# Altium schematic sheet УШЯИ.411618.029Э Э3 Лист 2.schdoc (part 2 of 2)
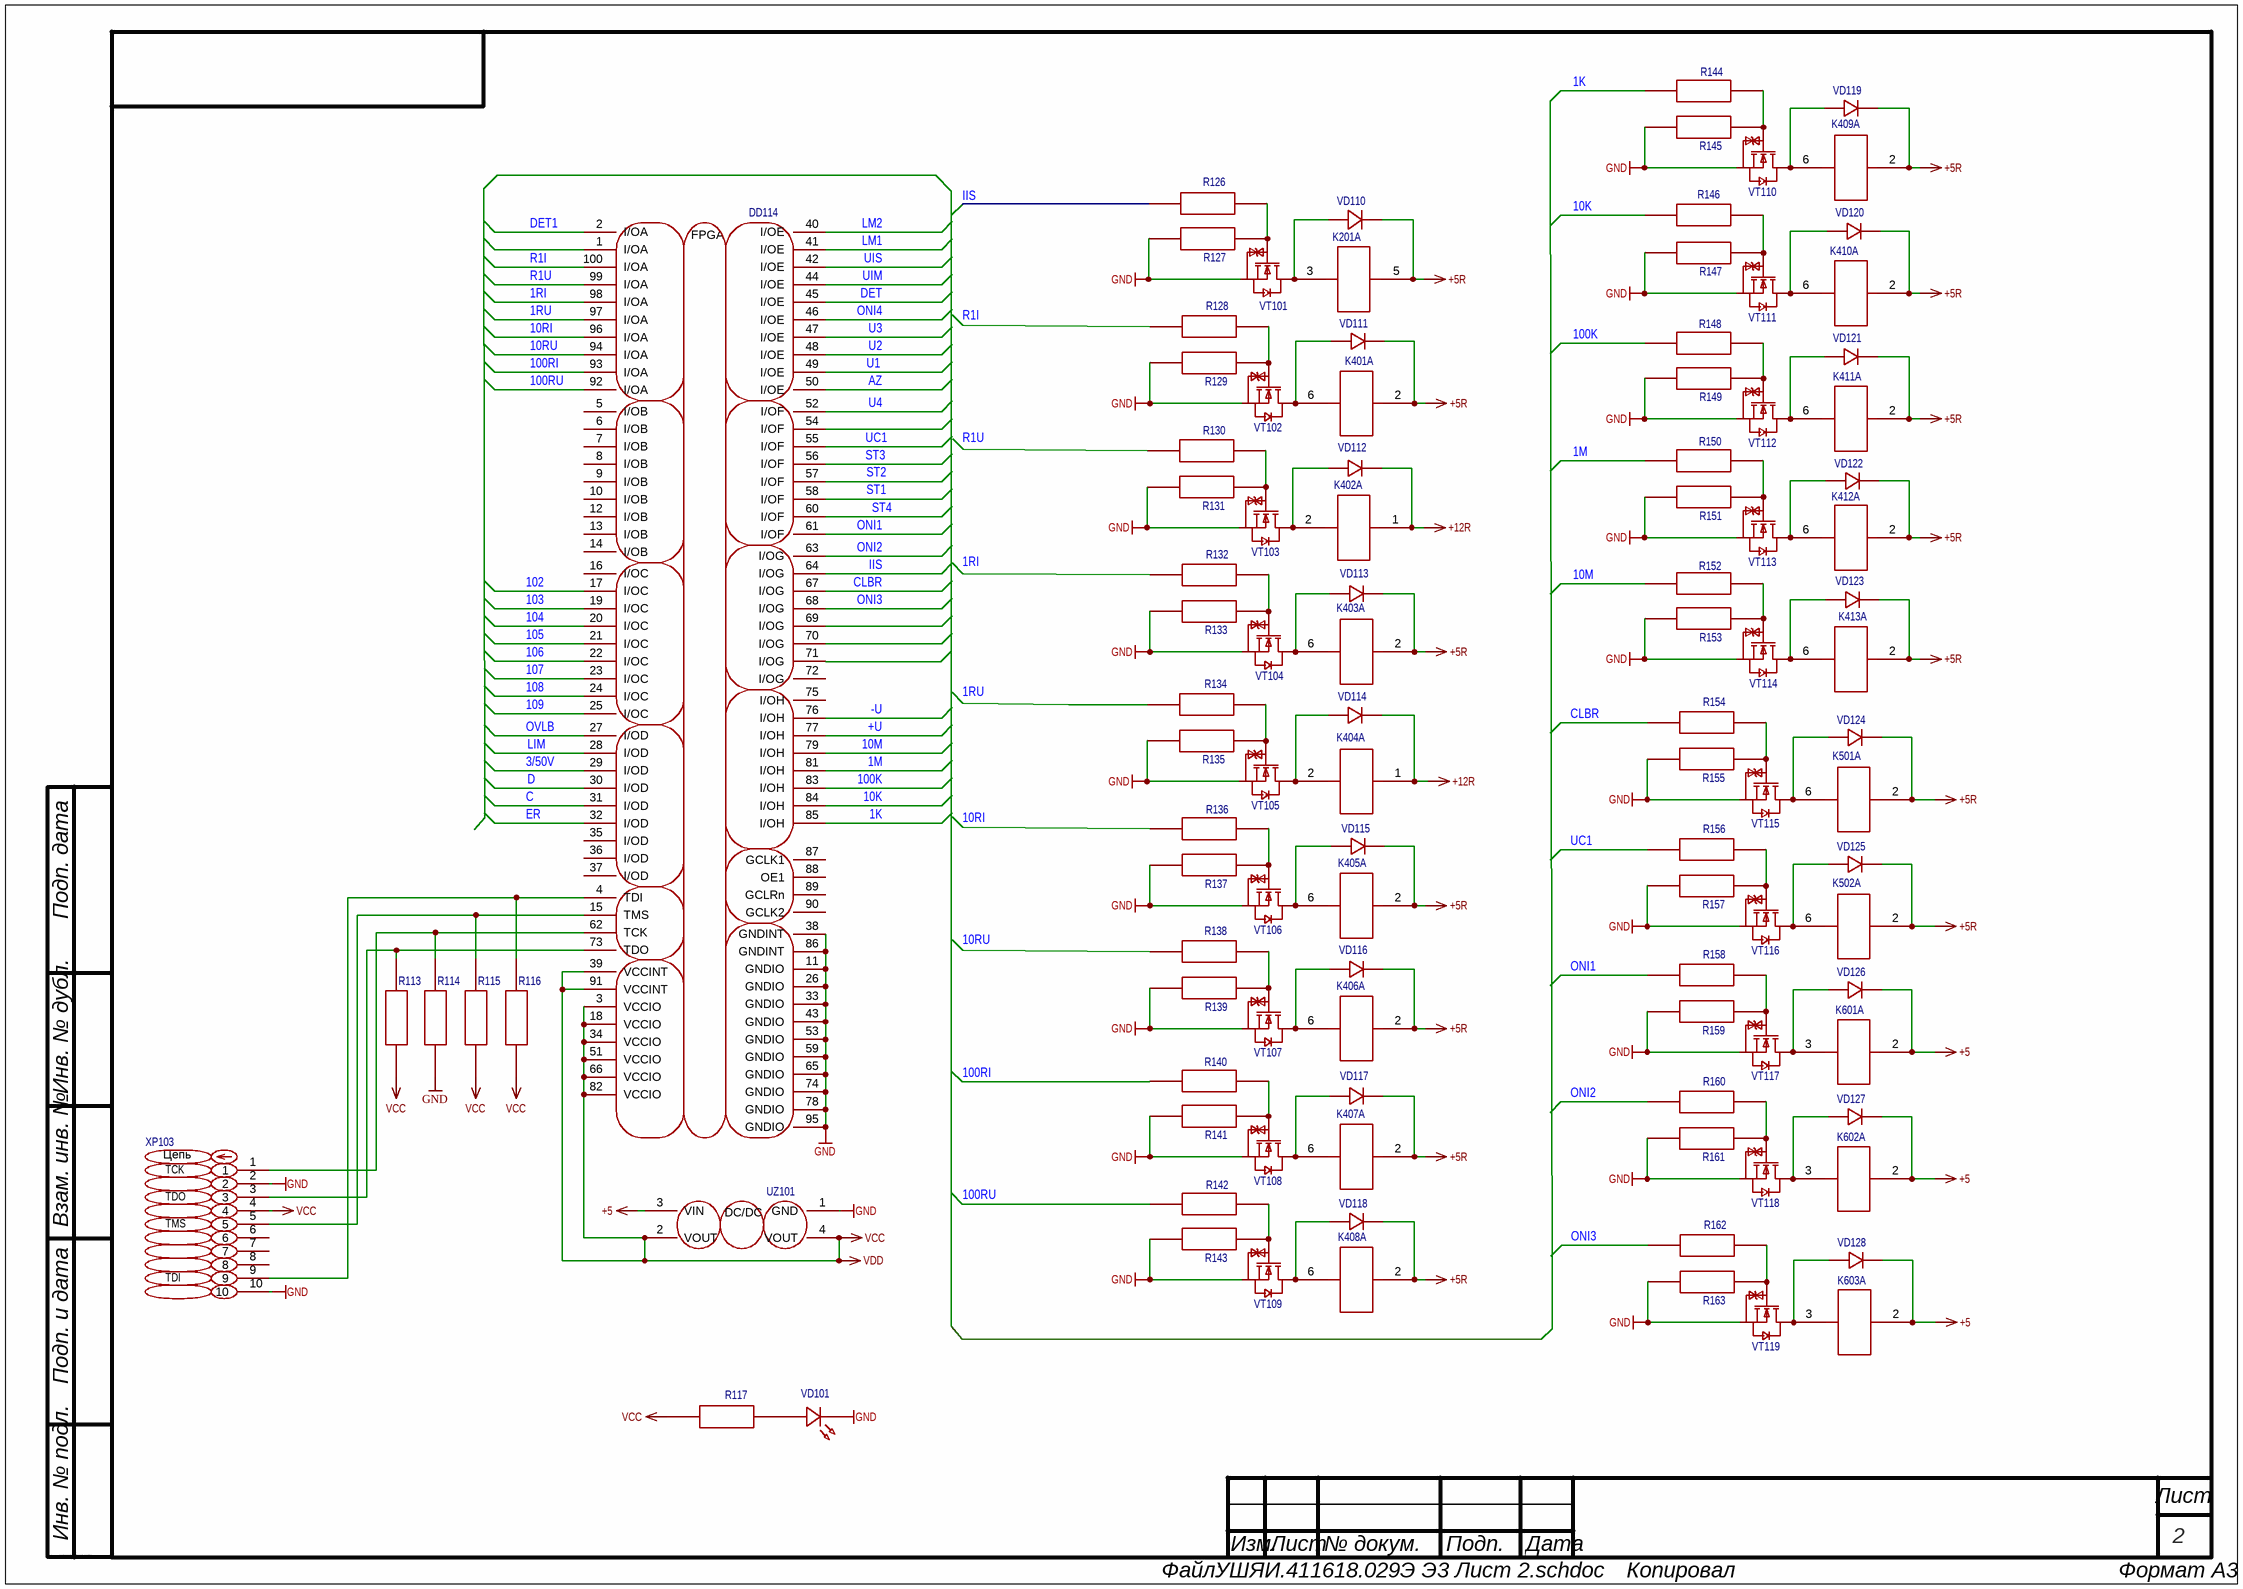
[diagram p1: УШЯИ.411618.029Э Э3 Лист 2.schdoc]

## Library data of the parts
DD114 = ПЛИС EPM3128ATC100-10N [TQFP-100]: Manufacturer: Intel/Altera; Contributor: jordanjin; Convert to PCB: yes; UniqueId: gge69bfa431c52bedcc; Origin Footprint: TQFP-100_L14.0-W14.0-P0.50-LS16.0-BL; Device: ПЛИС EPM3128ATC100-10N [TQFP-100]; Symbol: ПЛИС EPM3128ATC100-10N [TQFP-100]; spicePre: X; Supplier: LCSC; Manufacturer Part: EPM3128ATC100-10N; JLCPCB Part Class: Extended Part; spiceSymbolName: ПЛИС EPM3128ATC100-10N [TQFP-100]; Add into BOM: yes; FootprintName: TQFP-100_L14.0-W14.0-P0.50-LS16.0-BL
K201 = Реле герконовое SIL05-1A72-71L [PCB]: Manufacturer: STANDEXMEDER; subpart_no: 1; Origin Footprint: RELAY-TH_4P-L20.6-W5.9_STANDEXMEDER_SIL12-1A72-71L; Contributor: jordanjin; Convert to PCB: yes; UniqueId: gge5a920c36dc7e1466; ModelId: 7150b5ec7bbe4c7fa168fd25340efd63; Device: Реле герконовое SIL05-1A72-71L [PCB]; Symbol: Реле герконовое SIL05-1A72-71L [PCB]; Supplier: LCSC; Manufacturer Part: SIL05-1A72-71L; JLCPCB Part Class: Extended Part; spicePre: K; spiceSymbolName: Реле герконовое SIL05-1A72-71L [PCB]; Add into BOM: yes; FootprintName: RELAY-TH_4P-L20.6-W5.9_STANDEXMEDER_SIL12-1A72-71L; ModelName: RELAY-TH_4P-L20.6-W5.9_STANDEXMEDER_SIL12-1A72-71L
K401 = Реле герконовое DIP05-1A72-13L  [PCB]: Manufacturer: STANDEXMEDER; subpart_no: 1; Contributor: jordanjin; Convert to PCB: yes; UniqueId: ggea45fc22cc44c2d75; Origin Footprint: RELAY-TH_STANDEXMEDER_DIP05-1A72-13L; Device: Реле герконовое DIP05-1A72-13L  [PCB]; Symbol: Реле герконовое DIP05-1A72-13L  [PCB]; Supplier: LCSC; Supplier Part: C1524853; Manufacturer Part: DIP05-1A72-13L; JLCPCB Part Class: Extended Part; spicePre: K; spiceSymbolName: Реле герконовое DIP05-1A72-13L  [PCB]; Add into BOM: yes; FootprintName: RELAY-TH_STANDEXMEDER_DIP05-1A72-13L
K402 = Реле герконовое УШЯИ.685442.092 (2 реле): Manufacturer: ОАО"МНИПИ"; Part Number: 1; Origin Footprint: УШЯИ.685442.092 В2; Contributor: jordanjin; Convert to PCB: yes; UniqueId: ggedd096f2fa000e1a3; Device: Реле герконовое УШЯИ.685442.092 (2 реле); Symbol: Реле герконовое УШЯИ.685442.092 (2 реле); Supplier: LCSC; Manufacturer Part: УШЯИ.685442.092; Subpart_no: 1; Add into BOM: yes; spicePre: K; spiceSymbolName: Реле герконовое УШЯИ.685442.092 (2 реле)
K403 = Реле герконовое DIP05-1A72-13L  [PCB]: Manufacturer: STANDEXMEDER; subpart_no: 1; Contributor: jordanjin; Convert to PCB: yes; UniqueId: gge7b256544bc94d3e2; Origin Footprint: RELAY-TH_STANDEXMEDER_DIP05-1A72-13L; Device: Реле герконовое DIP05-1A72-13L  [PCB]; Symbol: Реле герконовое DIP05-1A72-13L  [PCB]; Supplier: LCSC; Supplier Part: C1524853; Manufacturer Part: DIP05-1A72-13L; JLCPCB Part Class: Extended Part; spicePre: K; spiceSymbolName: Реле герконовое DIP05-1A72-13L  [PCB]; Add into BOM: yes; FootprintName: RELAY-TH_STANDEXMEDER_DIP05-1A72-13L
K404 = Реле герконовое УШЯИ.685442.092 (1 реле): Manufacturer: ОАО"МНИПИ"; subpart_no: 1; Contributor: jordanjin; Convert to PCB: yes; UniqueId: ggec0474dfb349761fe; Origin Footprint: УШЯИ.685442.092; Device: Реле герконовое УШЯИ.685442.092 (1 реле); Symbol: Реле герконовое УШЯИ.685442.092 (1 реле); Supplier: LCSC; Manufacturer Part: УШЯИ.685442.092; JLCPCB Part Class: Extended Part; spicePre: K; spiceSymbolName: Реле герконовое УШЯИ.685442.092 (1 реле); Add into BOM: yes
K405 = Реле герконовое DIP05-1A72-13L  [PCB]: Manufacturer: STANDEXMEDER; subpart_no: 1; Contributor: jordanjin; Convert to PCB: yes; UniqueId: gge1f76a7dc702d7620; Origin Footprint: RELAY-TH_STANDEXMEDER_DIP05-1A72-13L; Device: Реле герконовое DIP05-1A72-13L  [PCB]; Symbol: Реле герконовое DIP05-1A72-13L  [PCB]; Supplier: LCSC; Supplier Part: C1524853; Manufacturer Part: DIP05-1A72-13L; JLCPCB Part Class: Extended Part; spicePre: K; spiceSymbolName: Реле герконовое DIP05-1A72-13L  [PCB]; Add into BOM: yes; FootprintName: RELAY-TH_STANDEXMEDER_DIP05-1A72-13L
K406 = Реле герконовое DIP05-1A72-13L  [PCB]: Manufacturer: STANDEXMEDER; subpart_no: 1; Contributor: jordanjin; Convert to PCB: yes; UniqueId: gge00973bedd4b06ae6; Origin Footprint: RELAY-TH_STANDEXMEDER_DIP05-1A72-13L; Device: Реле герконовое DIP05-1A72-13L  [PCB]; Symbol: Реле герконовое DIP05-1A72-13L  [PCB]; Supplier: LCSC; Supplier Part: C1524853; Manufacturer Part: DIP05-1A72-13L; JLCPCB Part Class: Extended Part; spicePre: K; spiceSymbolName: Реле герконовое DIP05-1A72-13L  [PCB]; Add into BOM: yes; FootprintName: RELAY-TH_STANDEXMEDER_DIP05-1A72-13L
K407 = Реле герконовое DIP05-1A72-13L  [PCB]: Manufacturer: STANDEXMEDER; subpart_no: 1; Contributor: jordanjin; Convert to PCB: yes; UniqueId: gge7eb223ed67f315be; Origin Footprint: RELAY-TH_STANDEXMEDER_DIP05-1A72-13L; Device: Реле герконовое DIP05-1A72-13L  [PCB]; Symbol: Реле герконовое DIP05-1A72-13L  [PCB]; Supplier: LCSC; Supplier Part: C1524853; Manufacturer Part: DIP05-1A72-13L; JLCPCB Part Class: Extended Part; spicePre: K; spiceSymbolName: Реле герконовое DIP05-1A72-13L  [PCB]; Add into BOM: yes; FootprintName: RELAY-TH_STANDEXMEDER_DIP05-1A72-13L
K408 = Реле герконовое DIP05-1A72-13L  [PCB]: Manufacturer: STANDEXMEDER; subpart_no: 1; Contributor: jordanjin; Convert to PCB: yes; UniqueId: ggea0a2675062cebf5e; Origin Footprint: RELAY-TH_STANDEXMEDER_DIP05-1A72-13L; Device: Реле герконовое DIP05-1A72-13L  [PCB]; Symbol: Реле герконовое DIP05-1A72-13L  [PCB]; Supplier: LCSC; Supplier Part: C1524853; Manufacturer Part: DIP05-1A72-13L; JLCPCB Part Class: Extended Part; spicePre: K; spiceSymbolName: Реле герконовое DIP05-1A72-13L  [PCB]; Add into BOM: yes; FootprintName: RELAY-TH_STANDEXMEDER_DIP05-1A72-13L
K409 = Реле герконовое DIP05-1A72-13L  [PCB]: Manufacturer: STANDEXMEDER; subpart_no: 1; Contributor: jordanjin; Convert to PCB: yes; UniqueId: ggee83d63be2b7c682e; Origin Footprint: RELAY-TH_STANDEXMEDER_DIP05-1A72-13L; Device: Реле герконовое DIP05-1A72-13L  [PCB]; Symbol: Реле герконовое DIP05-1A72-13L  [PCB]; Supplier: LCSC; Supplier Part: C1524853; Manufacturer Part: DIP05-1A72-13L; JLCPCB Part Class: Extended Part; spicePre: K; spiceSymbolName: Реле герконовое DIP05-1A72-13L  [PCB]; Add into BOM: yes; FootprintName: RELAY-TH_STANDEXMEDER_DIP05-1A72-13L
K410 = Реле герконовое DIP05-1A72-13L  [PCB]: Manufacturer: STANDEXMEDER; subpart_no: 1; Contributor: jordanjin; Convert to PCB: yes; UniqueId: gge77497d8361c4598c; Origin Footprint: RELAY-TH_STANDEXMEDER_DIP05-1A72-13L; Device: Реле герконовое DIP05-1A72-13L  [PCB]; Symbol: Реле герконовое DIP05-1A72-13L  [PCB]; Supplier: LCSC; Supplier Part: C1524853; Manufacturer Part: DIP05-1A72-13L; JLCPCB Part Class: Extended Part; spicePre: K; spiceSymbolName: Реле герконовое DIP05-1A72-13L  [PCB]; Add into BOM: yes; FootprintName: RELAY-TH_STANDEXMEDER_DIP05-1A72-13L
K411 = Реле герконовое DIP05-1A72-13L  [PCB]: Manufacturer: STANDEXMEDER; subpart_no: 1; Contributor: jordanjin; Convert to PCB: yes; UniqueId: gge695ef8e117c221b6; Origin Footprint: RELAY-TH_STANDEXMEDER_DIP05-1A72-13L; Device: Реле герконовое DIP05-1A72-13L  [PCB]; Symbol: Реле герконовое DIP05-1A72-13L  [PCB]; Supplier: LCSC; Supplier Part: C1524853; Manufacturer Part: DIP05-1A72-13L; JLCPCB Part Class: Extended Part; spicePre: K; spiceSymbolName: Реле герконовое DIP05-1A72-13L  [PCB]; Add into BOM: yes; FootprintName: RELAY-TH_STANDEXMEDER_DIP05-1A72-13L
K412 = Реле герконовое DIP05-1A72-13L  [PCB]: Manufacturer: STANDEXMEDER; subpart_no: 1; Contributor: jordanjin; Convert to PCB: yes; UniqueId: ggef9bf3a281ed54a33; Origin Footprint: RELAY-TH_STANDEXMEDER_DIP05-1A72-13L; Device: Реле герконовое DIP05-1A72-13L  [PCB]; Symbol: Реле герконовое DIP05-1A72-13L  [PCB]; Supplier: LCSC; Supplier Part: C1524853; Manufacturer Part: DIP05-1A72-13L; JLCPCB Part Class: Extended Part; spicePre: K; spiceSymbolName: Реле герконовое DIP05-1A72-13L  [PCB]; Add into BOM: yes; FootprintName: RELAY-TH_STANDEXMEDER_DIP05-1A72-13L
K413 = Реле герконовое DIP05-1A72-13L  [PCB]: Manufacturer: STANDEXMEDER; subpart_no: 1; Contributor: jordanjin; Convert to PCB: yes; UniqueId: gge75a4dccec15134f1; Origin Footprint: RELAY-TH_STANDEXMEDER_DIP05-1A72-13L; Device: Реле герконовое DIP05-1A72-13L  [PCB]; Symbol: Реле герконовое DIP05-1A72-13L  [PCB]; Supplier: LCSC; Supplier Part: C1524853; Manufacturer Part: DIP05-1A72-13L; JLCPCB Part Class: Extended Part; spicePre: K; spiceSymbolName: Реле герконовое DIP05-1A72-13L  [PCB]; Add into BOM: yes; FootprintName: RELAY-TH_STANDEXMEDER_DIP05-1A72-13L
K501 = Реле герконовое DIP05-1A72-13L  [PCB]: Manufacturer: STANDEXMEDER; subpart_no: 1; Contributor: jordanjin; Convert to PCB: yes; UniqueId: ggee1438345d4d73398; Origin Footprint: RELAY-TH_STANDEXMEDER_DIP05-1A72-13L; Device: Реле герконовое DIP05-1A72-13L  [PCB]; Symbol: Реле герконовое DIP05-1A72-13L  [PCB]; Supplier: LCSC; Supplier Part: C1524853; Manufacturer Part: DIP05-1A72-13L; JLCPCB Part Class: Extended Part; spicePre: K; spiceSymbolName: Реле герконовое DIP05-1A72-13L  [PCB]; Add into BOM: yes; FootprintName: RELAY-TH_STANDEXMEDER_DIP05-1A72-13L
K502 = Реле герконовое DIP05-1A72-13L  [PCB]: Manufacturer: STANDEXMEDER; subpart_no: 1; Contributor: jordanjin; Convert to PCB: yes; UniqueId: ggee8b9abbf2c4f7e1a; Origin Footprint: RELAY-TH_STANDEXMEDER_DIP05-1A72-13L; Device: Реле герконовое DIP05-1A72-13L  [PCB]; Symbol: Реле герконовое DIP05-1A72-13L  [PCB]; Supplier: LCSC; Supplier Part: C1524853; Manufacturer Part: DIP05-1A72-13L; JLCPCB Part Class: Extended Part; spicePre: K; spiceSymbolName: Реле герконовое DIP05-1A72-13L  [PCB]; Add into BOM: yes; FootprintName: RELAY-TH_STANDEXMEDER_DIP05-1A72-13L
K601 = Реле герконовое DIP05-1C90-51L [PCB]: Manufacturer: STANDEXMEDER; subpart_no: 1; Origin Footprint: RELAY-TH_STANDEXMEDER_DIP05-1C90-51L; Contributor: jordanjin; Convert to PCB: yes; UniqueId: ggef1f82220597a25dc; ModelId: 9ce20f042c4243a9be1ebcff3b9f4bf9; Device: Реле герконовое DIP05-1C90-51L [PCB]; Symbol: Реле герконовое DIP05-1C90-51L [PCB]; Supplier: LCSC; Manufacturer Part: DIP05-1C90-51L; JLCPCB Part Class: Extended Part; spicePre: K; spiceSymbolName: Реле герконовое DIP05-1C90-51L [PCB]; Add into BOM: yes; FootprintName: RELAY-TH_STANDEXMEDER_DIP05-1C90-51L; ModelName: RELAY-TH_STANDEXMEDER_DIP05-1C90-51L
K602 K603 = Реле герконовое DIP05-1C90-51L [PCB]: Manufacturer: STANDEXMEDER; subpart_no: 1; Origin Footprint: RELAY-TH_STANDEXMEDER_DIP05-1C90-51L; Contributor: jordanjin; Convert to PCB: yes; UniqueId: gge32902d80266dcdbb; ModelId: 9ce20f042c4243a9be1ebcff3b9f4bf9; Device: Реле герконовое DIP05-1C90-51L [PCB]; Symbol: Реле герконовое DIP05-1C90-51L [PCB]; Supplier: LCSC; Manufacturer Part: DIP05-1C90-51L; JLCPCB Part Class: Extended Part; spicePre: K; spiceSymbolName: Реле герконовое DIP05-1C90-51L [PCB]; Add into BOM: yes; FootprintName: RELAY-TH_STANDEXMEDER_DIP05-1C90-51L; ModelName: RELAY-TH_STANDEXMEDER_DIP05-1C90-51L
R113 = Резистор 1кОм 0,125Вт 1% [0805]: Contributor: jordanjin; Convert to PCB: yes; UniqueId: ggefc65a99cb1671a37; ModelId: de27d504f5024d53a3020ec2611f5e5e; Origin Footprint: R0805; Device: Резистор 1кОм 0,125Вт 1% [0805]; Symbol: Резистор 1кОм 0,125Вт 1% [0805]; Manufacturer Part: R0805; spicePre: R; spiceSymbolName: Резистор 12кОм 0,125Вт 1% [0805]; Add into BOM: yes; FootprintName: R0805; ModelName: R0805
R114 = Резистор 1кОм 0,125Вт 1% [0805]: Contributor: jordanjin; Convert to PCB: yes; UniqueId: ggec2b6080563c7f1a9; ModelId: de27d504f5024d53a3020ec2611f5e5e; Origin Footprint: R0805; Device: Резистор 1кОм 0,125Вт 1% [0805]; Symbol: Резистор 1кОм 0,125Вт 1% [0805]; Manufacturer Part: R0805; spicePre: R; spiceSymbolName: Резистор 12кОм 0,125Вт 1% [0805]; Add into BOM: yes; FootprintName: R0805; ModelName: R0805
R115 = Резистор 1кОм 0,125Вт 1% [0805]: Contributor: jordanjin; Convert to PCB: yes; UniqueId: gge64c21d50f88cd611; ModelId: de27d504f5024d53a3020ec2611f5e5e; Origin Footprint: R0805; Device: Резистор 1кОм 0,125Вт 1% [0805]; Symbol: Резистор 1кОм 0,125Вт 1% [0805]; Manufacturer Part: R0805; spicePre: R; spiceSymbolName: Резистор 12кОм 0,125Вт 1% [0805]; Add into BOM: yes; FootprintName: R0805; ModelName: R0805
R116 = Резистор 1кОм 0,125Вт 1% [0805]: Contributor: jordanjin; Convert to PCB: yes; UniqueId: gge7a48b93cbe1f66c7; ModelId: de27d504f5024d53a3020ec2611f5e5e; Origin Footprint: R0805; Device: Резистор 1кОм 0,125Вт 1% [0805]; Symbol: Резистор 1кОм 0,125Вт 1% [0805]; Manufacturer Part: R0805; spicePre: R; spiceSymbolName: Резистор 12кОм 0,125Вт 1% [0805]; Add into BOM: yes; FootprintName: R0805; ModelName: R0805
R117 = Резистор 100Ом 0,125Вт 1% [0805]: Contributor: jordanjin; Convert to PCB: yes; UniqueId: gge264200b346de9972; ModelId: de27d504f5024d53a3020ec2611f5e5e; Origin Footprint: R0805; Device: Резистор 100Ом 0,125Вт 1% [0805]; Symbol: Резистор 100Ом 0,125Вт 1% [0805]; Manufacturer Part: R0805; spicePre: R; spiceSymbolName: Резистор 12кОм 0,125Вт 1% [0805]; Add into BOM: yes; FootprintName: R0805; ModelName: R0805
R126 = Резистор 100Ом 0,125Вт 1% [0805]: Contributor: jordanjin; Convert to PCB: yes; UniqueId: ggeb84eb3975a3fb34b; ModelId: de27d504f5024d53a3020ec2611f5e5e; Origin Footprint: R0805; Device: Резистор 100Ом 0,125Вт 1% [0805]; Symbol: Резистор 100Ом 0,125Вт 1% [0805]; Manufacturer Part: R0805; spicePre: R; spiceSymbolName: Резистор 12кОм 0,125Вт 1% [0805]; Add into BOM: yes; FootprintName: R0805; ModelName: R0805
R127 = Резистор 100Ом 0,125Вт 1% [0805]: Contributor: jordanjin; Convert to PCB: yes; UniqueId: gge1de39afe1abf2d5f; ModelId: de27d504f5024d53a3020ec2611f5e5e; Origin Footprint: R0805; Device: Резистор 100Ом 0,125Вт 1% [0805]; Symbol: Резистор 100Ом 0,125Вт 1% [0805]; Manufacturer Part: R0805; spicePre: R; spiceSymbolName: Резистор 12кОм 0,125Вт 1% [0805]; Add into BOM: yes; FootprintName: R0805; ModelName: R0805
R128 = Резистор 100Ом 0,125Вт 1% [DIP]: Origin Footprint: R0.125W; Contributor: jordanjin; Convert to PCB: yes; UniqueId: gge4e9655f68a8dafce; Device: Резистор 100Ом 0,125Вт 1% [DIP]; Symbol: Резистор 100Ом 0,125Вт 1% [DIP]; Manufacturer Part: R0805; spicePre: R; spiceSymbolName: Резистор 100Ом 0,125Вт 1% [DIP]; Add into BOM: yes
R129 = Резистор 100Ом 0,125Вт 1% [0805]: Contributor: jordanjin; Convert to PCB: yes; UniqueId: gge15c989a1a56d1139; ModelId: de27d504f5024d53a3020ec2611f5e5e; Origin Footprint: R0805; Device: Резистор 100Ом 0,125Вт 1% [0805]; Symbol: Резистор 100Ом 0,125Вт 1% [0805]; Manufacturer Part: R0805; spicePre: R; spiceSymbolName: Резистор 12кОм 0,125Вт 1% [0805]; Add into BOM: yes; FootprintName: R0805; ModelName: R0805
R130 = Резистор 100Ом 0,125Вт 1% [DIP]: Origin Footprint: R0.125W; Contributor: jordanjin; Convert to PCB: yes; UniqueId: gge4dae1ceed1638d27; Device: Резистор 100Ом 0,125Вт 1% [DIP]; Symbol: Резистор 100Ом 0,125Вт 1% [DIP]; Manufacturer Part: R0805; spicePre: R; spiceSymbolName: Резистор 100Ом 0,125Вт 1% [DIP]; Add into BOM: yes
R131 = Резистор 100Ом 0,125Вт 1% [0805]: Contributor: jordanjin; Convert to PCB: yes; UniqueId: ggee0de59b0d0accf9e; ModelId: de27d504f5024d53a3020ec2611f5e5e; Origin Footprint: R0805; Device: Резистор 100Ом 0,125Вт 1% [0805]; Symbol: Резистор 100Ом 0,125Вт 1% [0805]; Manufacturer Part: R0805; spicePre: R; spiceSymbolName: Резистор 12кОм 0,125Вт 1% [0805]; Add into BOM: yes; FootprintName: R0805; ModelName: R0805
R132 = Резистор 100Ом 0,125Вт 1% [DIP]: Origin Footprint: R0.125W; Contributor: jordanjin; Convert to PCB: yes; UniqueId: ggee36e9b7f0e93b298; Device: Резистор 100Ом 0,125Вт 1% [DIP]; Symbol: Резистор 100Ом 0,125Вт 1% [DIP]; Manufacturer Part: R0805; spicePre: R; spiceSymbolName: Резистор 100Ом 0,125Вт 1% [DIP]; Add into BOM: yes
R133 = Резистор 100Ом 0,125Вт 1% [0805]: Contributor: jordanjin; Convert to PCB: yes; UniqueId: gge983ca56eedb453e4; ModelId: de27d504f5024d53a3020ec2611f5e5e; Origin Footprint: R0805; Device: Резистор 100Ом 0,125Вт 1% [0805]; Symbol: Резистор 100Ом 0,125Вт 1% [0805]; Manufacturer Part: R0805; spicePre: R; spiceSymbolName: Резистор 12кОм 0,125Вт 1% [0805]; Add into BOM: yes; FootprintName: R0805; ModelName: R0805
R134 = Резистор 100Ом 0,125Вт 1% [DIP]: Origin Footprint: R0.125W; Contributor: jordanjin; Convert to PCB: yes; UniqueId: gge3d38ae09e62b8b32; Device: Резистор 100Ом 0,125Вт 1% [DIP]; Symbol: Резистор 100Ом 0,125Вт 1% [DIP]; Manufacturer Part: R0805; spicePre: R; spiceSymbolName: Резистор 100Ом 0,125Вт 1% [DIP]; Add into BOM: yes
R135 = Резистор 100Ом 0,125Вт 1% [0805]: Contributor: jordanjin; Convert to PCB: yes; UniqueId: gge09ad5689e5294181; ModelId: de27d504f5024d53a3020ec2611f5e5e; Origin Footprint: R0805; Device: Резистор 100Ом 0,125Вт 1% [0805]; Symbol: Резистор 100Ом 0,125Вт 1% [0805]; Manufacturer Part: R0805; spicePre: R; spiceSymbolName: Резистор 12кОм 0,125Вт 1% [0805]; Add into BOM: yes; FootprintName: R0805; ModelName: R0805
R136 = Резистор 100Ом 0,125Вт 1% [DIP]: Origin Footprint: R0.125W; Contributor: jordanjin; Convert to PCB: yes; UniqueId: gge2dab259ff1c17ce2; Device: Резистор 100Ом 0,125Вт 1% [DIP]; Symbol: Резистор 100Ом 0,125Вт 1% [DIP]; Manufacturer Part: R0805; spicePre: R; spiceSymbolName: Резистор 100Ом 0,125Вт 1% [DIP]; Add into BOM: yes
R137 = Резистор 100Ом 0,125Вт 1% [0805]: Contributor: jordanjin; Convert to PCB: yes; UniqueId: gge06fa5f47d91d6bb1; ModelId: de27d504f5024d53a3020ec2611f5e5e; Origin Footprint: R0805; Device: Резистор 100Ом 0,125Вт 1% [0805]; Symbol: Резистор 100Ом 0,125Вт 1% [0805]; Manufacturer Part: R0805; spicePre: R; spiceSymbolName: Резистор 12кОм 0,125Вт 1% [0805]; Add into BOM: yes; FootprintName: R0805; ModelName: R0805
R138 = Резистор 100Ом 0,125Вт 1% [DIP]: Origin Footprint: R0.125W; Contributor: jordanjin; Convert to PCB: yes; UniqueId: ggef6bf27152fd71dfe; Device: Резистор 100Ом 0,125Вт 1% [DIP]; Symbol: Резистор 100Ом 0,125Вт 1% [DIP]; Manufacturer Part: R0805; spicePre: R; spiceSymbolName: Резистор 100Ом 0,125Вт 1% [DIP]; Add into BOM: yes
R139 = Резистор 100Ом 0,125Вт 1% [0805]: Contributor: jordanjin; Convert to PCB: yes; UniqueId: gge8d46e455117a8b37; ModelId: de27d504f5024d53a3020ec2611f5e5e; Origin Footprint: R0805; Device: Резистор 100Ом 0,125Вт 1% [0805]; Symbol: Резистор 100Ом 0,125Вт 1% [0805]; Manufacturer Part: R0805; spicePre: R; spiceSymbolName: Резистор 12кОм 0,125Вт 1% [0805]; Add into BOM: yes; FootprintName: R0805; ModelName: R0805
R140 = Резистор 100Ом 0,125Вт 1% [DIP]: Origin Footprint: R0.125W; Contributor: jordanjin; Convert to PCB: yes; UniqueId: gge4ec196be36a645b6; Device: Резистор 100Ом 0,125Вт 1% [DIP]; Symbol: Резистор 100Ом 0,125Вт 1% [DIP]; Manufacturer Part: R0805; spicePre: R; spiceSymbolName: Резистор 100Ом 0,125Вт 1% [DIP]; Add into BOM: yes
R141 = Резистор 100Ом 0,125Вт 1% [0805]: Contributor: jordanjin; Convert to PCB: yes; UniqueId: gge9aeb16e17deead7c; ModelId: de27d504f5024d53a3020ec2611f5e5e; Origin Footprint: R0805; Device: Резистор 100Ом 0,125Вт 1% [0805]; Symbol: Резистор 100Ом 0,125Вт 1% [0805]; Manufacturer Part: R0805; spicePre: R; spiceSymbolName: Резистор 12кОм 0,125Вт 1% [0805]; Add into BOM: yes; FootprintName: R0805; ModelName: R0805
R142 = Резистор 100Ом 0,125Вт 1% [DIP]: Origin Footprint: R0.125W; Contributor: jordanjin; Convert to PCB: yes; UniqueId: gge15ebc2f7908fa8bd; Device: Резистор 100Ом 0,125Вт 1% [DIP]; Symbol: Резистор 100Ом 0,125Вт 1% [DIP]; Manufacturer Part: R0805; spicePre: R; spiceSymbolName: Резистор 100Ом 0,125Вт 1% [DIP]; Add into BOM: yes
R143 = Резистор 100Ом 0,125Вт 1% [0805]: Contributor: jordanjin; Convert to PCB: yes; UniqueId: gge284a2cddc6cc5500; ModelId: de27d504f5024d53a3020ec2611f5e5e; Origin Footprint: R0805; Device: Резистор 100Ом 0,125Вт 1% [0805]; Symbol: Резистор 100Ом 0,125Вт 1% [0805]; Manufacturer Part: R0805; spicePre: R; spiceSymbolName: Резистор 12кОм 0,125Вт 1% [0805]; Add into BOM: yes; FootprintName: R0805; ModelName: R0805
R144 = Резистор 100Ом 0,125Вт 1% [DIP]: Origin Footprint: R0.125W; Contributor: jordanjin; Convert to PCB: yes; UniqueId: ggeaa410eb8306d9a98; Device: Резистор 100Ом 0,125Вт 1% [DIP]; Symbol: Резистор 100Ом 0,125Вт 1% [DIP]; Manufacturer Part: R0805; spicePre: R; spiceSymbolName: Резистор 100Ом 0,125Вт 1% [DIP]; Add into BOM: yes
R145 = Резистор 100Ом 0,125Вт 1% [0805]: Contributor: jordanjin; Convert to PCB: yes; UniqueId: gge17e49b262f8c481a; ModelId: de27d504f5024d53a3020ec2611f5e5e; Origin Footprint: R0805; Device: Резистор 100Ом 0,125Вт 1% [0805]; Symbol: Резистор 100Ом 0,125Вт 1% [0805]; Manufacturer Part: R0805; spicePre: R; spiceSymbolName: Резистор 12кОм 0,125Вт 1% [0805]; Add into BOM: yes; FootprintName: R0805; ModelName: R0805
R146 = Резистор 100Ом 0,125Вт 1% [DIP]: Origin Footprint: R0.125W; Contributor: jordanjin; Convert to PCB: yes; UniqueId: gge6c0c4eb072c61abf; Device: Резистор 100Ом 0,125Вт 1% [DIP]; Symbol: Резистор 100Ом 0,125Вт 1% [DIP]; Manufacturer Part: R0805; spicePre: R; spiceSymbolName: Резистор 100Ом 0,125Вт 1% [DIP]; Add into BOM: yes
R147 = Резистор 100Ом 0,125Вт 1% [0805]: Contributor: jordanjin; Convert to PCB: yes; UniqueId: ggeb272b0e92569094a; ModelId: de27d504f5024d53a3020ec2611f5e5e; Origin Footprint: R0805; Device: Резистор 100Ом 0,125Вт 1% [0805]; Symbol: Резистор 100Ом 0,125Вт 1% [0805]; Manufacturer Part: R0805; spicePre: R; spiceSymbolName: Резистор 12кОм 0,125Вт 1% [0805]; Add into BOM: yes; FootprintName: R0805; ModelName: R0805
R148 = Резистор 100Ом 0,125Вт 1% [DIP]: Origin Footprint: R0.125W; Contributor: jordanjin; Convert to PCB: yes; UniqueId: ggefae903f526e3c9e3; Device: Резистор 100Ом 0,125Вт 1% [DIP]; Symbol: Резистор 100Ом 0,125Вт 1% [DIP]; Manufacturer Part: R0805; spicePre: R; spiceSymbolName: Резистор 100Ом 0,125Вт 1% [DIP]; Add into BOM: yes
R149 = Резистор 100Ом 0,125Вт 1% [0805]: Contributor: jordanjin; Convert to PCB: yes; UniqueId: gge3dbaf11969537092; ModelId: de27d504f5024d53a3020ec2611f5e5e; Origin Footprint: R0805; Device: Резистор 100Ом 0,125Вт 1% [0805]; Symbol: Резистор 100Ом 0,125Вт 1% [0805]; Manufacturer Part: R0805; spicePre: R; spiceSymbolName: Резистор 12кОм 0,125Вт 1% [0805]; Add into BOM: yes; FootprintName: R0805; ModelName: R0805
R150 = Резистор 100Ом 0,125Вт 1% [DIP]: Origin Footprint: R0.125W; Contributor: jordanjin; Convert to PCB: yes; UniqueId: gge380871a5e186252d; Device: Резистор 100Ом 0,125Вт 1% [DIP]; Symbol: Резистор 100Ом 0,125Вт 1% [DIP]; Manufacturer Part: R0805; spicePre: R; spiceSymbolName: Резистор 100Ом 0,125Вт 1% [DIP]; Add into BOM: yes
R151 = Резистор 100Ом 0,125Вт 1% [0805]: Contributor: jordanjin; Convert to PCB: yes; UniqueId: gge063679ac9d12fccf; ModelId: de27d504f5024d53a3020ec2611f5e5e; Origin Footprint: R0805; Device: Резистор 100Ом 0,125Вт 1% [0805]; Symbol: Резистор 100Ом 0,125Вт 1% [0805]; Manufacturer Part: R0805; spicePre: R; spiceSymbolName: Резистор 12кОм 0,125Вт 1% [0805]; Add into BOM: yes; FootprintName: R0805; ModelName: R0805
R152 = Резистор 100Ом 0,125Вт 1% [DIP]: Origin Footprint: R0.125W; Contributor: jordanjin; Convert to PCB: yes; UniqueId: gge124f740b155750b2; Device: Резистор 100Ом 0,125Вт 1% [DIP]; Symbol: Резистор 100Ом 0,125Вт 1% [DIP]; Manufacturer Part: R0805; spicePre: R; spiceSymbolName: Резистор 100Ом 0,125Вт 1% [DIP]; Add into BOM: yes
R153 = Резистор 100Ом 0,125Вт 1% [0805]: Contributor: jordanjin; Convert to PCB: yes; UniqueId: gge27cee84ce076b68f; ModelId: de27d504f5024d53a3020ec2611f5e5e; Origin Footprint: R0805; Device: Резистор 100Ом 0,125Вт 1% [0805]; Symbol: Резистор 100Ом 0,125Вт 1% [0805]; Manufacturer Part: R0805; spicePre: R; spiceSymbolName: Резистор 12кОм 0,125Вт 1% [0805]; Add into BOM: yes; FootprintName: R0805; ModelName: R0805
R154 = Резистор 100Ом 0,125Вт 1% [DIP]: Origin Footprint: R0.125W; Contributor: jordanjin; Convert to PCB: yes; UniqueId: gge2e28954fc8669dd0; Device: Резистор 100Ом 0,125Вт 1% [DIP]; Symbol: Резистор 100Ом 0,125Вт 1% [DIP]; Manufacturer Part: R0805; spicePre: R; spiceSymbolName: Резистор 100Ом 0,125Вт 1% [DIP]; Add into BOM: yes
R155 = Резистор 100Ом 0,125Вт 1% [0805]: Contributor: jordanjin; Convert to PCB: yes; UniqueId: ggef886a17660e3a033; ModelId: de27d504f5024d53a3020ec2611f5e5e; Origin Footprint: R0805; Device: Резистор 100Ом 0,125Вт 1% [0805]; Symbol: Резистор 100Ом 0,125Вт 1% [0805]; Manufacturer Part: R0805; spicePre: R; spiceSymbolName: Резистор 12кОм 0,125Вт 1% [0805]; Add into BOM: yes; FootprintName: R0805; ModelName: R0805
R156 = Резистор 100Ом 0,125Вт 1% [DIP]: Origin Footprint: R0.125W; Contributor: jordanjin; Convert to PCB: yes; UniqueId: gge3cc4b2cca3c10891; Device: Резистор 100Ом 0,125Вт 1% [DIP]; Symbol: Резистор 100Ом 0,125Вт 1% [DIP]; Manufacturer Part: R0805; spicePre: R; spiceSymbolName: Резистор 100Ом 0,125Вт 1% [DIP]; Add into BOM: yes
R157 = Резистор 100Ом 0,125Вт 1% [0805]: Contributor: jordanjin; Convert to PCB: yes; UniqueId: gge7376950e8c8d98c9; ModelId: de27d504f5024d53a3020ec2611f5e5e; Origin Footprint: R0805; Device: Резистор 100Ом 0,125Вт 1% [0805]; Symbol: Резистор 100Ом 0,125Вт 1% [0805]; Manufacturer Part: R0805; spicePre: R; spiceSymbolName: Резистор 12кОм 0,125Вт 1% [0805]; Add into BOM: yes; FootprintName: R0805; ModelName: R0805
R158 = Резистор 100Ом 0,125Вт 1% [DIP]: Origin Footprint: R0.125W; Contributor: jordanjin; Convert to PCB: yes; UniqueId: gge4aba1a7132827d07; Device: Резистор 100Ом 0,125Вт 1% [DIP]; Symbol: Резистор 100Ом 0,125Вт 1% [DIP]; Manufacturer Part: R0805; spicePre: R; spiceSymbolName: Резистор 100Ом 0,125Вт 1% [DIP]; Add into BOM: yes
R159 = Резистор 100Ом 0,125Вт 1% [0805]: Contributor: jordanjin; Convert to PCB: yes; UniqueId: ggea32ed60242957927; ModelId: de27d504f5024d53a3020ec2611f5e5e; Origin Footprint: R0805; Device: Резистор 100Ом 0,125Вт 1% [0805]; Symbol: Резистор 100Ом 0,125Вт 1% [0805]; Manufacturer Part: R0805; spicePre: R; spiceSymbolName: Резистор 12кОм 0,125Вт 1% [0805]; Add into BOM: yes; FootprintName: R0805; ModelName: R0805
R160 R162 = Резистор 100Ом 0,125Вт 1% [DIP]: Origin Footprint: R0.125W; Contributor: jordanjin; Convert to PCB: yes; UniqueId: gge22a93cc7911c3764; Device: Резистор 100Ом 0,125Вт 1% [DIP]; Symbol: Резистор 100Ом 0,125Вт 1% [DIP]; Manufacturer Part: R0805; spicePre: R; spiceSymbolName: Резистор 100Ом 0,125Вт 1% [DIP]; Add into BOM: yes
R161 R163 = Резистор 100Ом 0,125Вт 1% [0805]: Contributor: jordanjin; Convert to PCB: yes; UniqueId: ggef701d6db619cb508; ModelId: de27d504f5024d53a3020ec2611f5e5e; Origin Footprint: R0805; Device: Резистор 100Ом 0,125Вт 1% [0805]; Symbol: Резистор 100Ом 0,125Вт 1% [0805]; Manufacturer Part: R0805; spicePre: R; spiceSymbolName: Резистор 12кОм 0,125Вт 1% [0805]; Add into BOM: yes; FootprintName: R0805; ModelName: R0805
UZ101 = Линейный регулятор напряжения LM1117GS-3.3 [SOT-223]: Manufacturer: HTC; Contributor: jordanjin; Convert to PCB: yes; UniqueId: ggebbc6c2b0414b7192; Origin Footprint: SOT-223-3_L6.5-W3.4-P2.30-LS7.0-BR; Device: Линейный регулятор напряжения LM1117GS-3.3 [SOT-223]; Symbol: Линейный регулятор напряжения LM1117GS-3.3 [SOT-223]; Supplier: LCSC; Supplier Part: C411821; Manufacturer Part: LM1117GS-3.3; JLCPCB Part Class: Extended Part; spicePre: U; spiceSymbolName: Линейный регулятор напряжения LM1117GS-3.3 [SOT-223]; Add into BOM: yes; FootprintName: SOT-223-3_L6.5-W3.4-P2.30-LS7.0-BR
VD101 = Светодиод YLED0805YG [0805]: Manufacturer: YONGYUTAI(永裕泰); Contributor: lcsc; Convert to PCB: yes; UniqueId: gge55c891089defb0cc; Origin Footprint: LED0805-R-RD; Device: Светодиод YLED0805YG [0805]; Symbol: Светодиод YLED0805YG [0805]; Supplier: LCSC; Supplier Part: C19171393; Manufacturer Part: YLED0805YG; JLCPCB Part Class: Extended Part; spicePre: U; spiceSymbolName: YLED0805YG; Add into BOM: yes; FootprintName: LED0805-R-RD
VD110 = Диод импульсный 1N4448 [SOD-123]: Manufacturer: YANGJIE; Manufacturer Part: 1N4448WQ; Contributor: jordanjin; Convert to PCB: yes; UniqueId: gge7db06b9b0cd09909; ModelId: 5a61cd31046d4447ba73169a45a0935b; Origin Footprint: SOD-123_L2.7-W1.6-LS3.7-RD-1; Device: Диод импульсный 1N4448 [SOD-123]; Symbol: Диод импульсный 1N4448 [SOD-123]; Supplier: LCSC; JLCPCB Part Class: Extended Part; spicePre: V; spiceSymbolName: Диод импульсный 1N4448 [SOD-123]; Add into BOM: yes; FootprintName: SOD-123_L2.7-W1.6-LS3.7-RD-1; ModelName: SOD-123_L2.7-W1.6-LS3.7-RD-1
VD111 = Диод импульсный 1N4448 [DO-35]: Manufacturer: onsemi; Manufacturer Part: 1N4448TR; Contributor: jordanjin; Convert to PCB: yes; UniqueId: gge1dc3ee198911c888; Origin Footprint: DO-35_BD2.0-L4.2-P8.20-D0.5-RD; Device: Диод импульсный 1N4448 [DO-35]; Symbol: Диод импульсный 1N4448 [DO-35]; Supplier: LCSC; JLCPCB Part Class: Extended Part; spicePre: V; spiceSymbolName: Диод импульсный 1N4448 [DO-35]; Add into BOM: yes; FootprintName: DO-35_BD2.0-L4.2-P8.20-D0.5-RD
VD112 = Диод импульсный 1N4448 [DO-35]: Manufacturer: onsemi; Manufacturer Part: 1N4448TR; Contributor: jordanjin; Convert to PCB: yes; UniqueId: gge9ea33a3634705890; Origin Footprint: DO-35_BD2.0-L4.2-P8.20-D0.5-RD; Device: Диод импульсный 1N4448 [DO-35]; Symbol: Диод импульсный 1N4448 [DO-35]; Supplier: LCSC; JLCPCB Part Class: Extended Part; spicePre: V; spiceSymbolName: Диод импульсный 1N4448 [DO-35]; Add into BOM: yes; FootprintName: DO-35_BD2.0-L4.2-P8.20-D0.5-RD
VD113 = Диод импульсный 1N4448 [DO-35]: Manufacturer: onsemi; Manufacturer Part: 1N4448TR; Contributor: jordanjin; Convert to PCB: yes; UniqueId: gge0b98b54c202bc52f; Origin Footprint: DO-35_BD2.0-L4.2-P8.20-D0.5-RD; Device: Диод импульсный 1N4448 [DO-35]; Symbol: Диод импульсный 1N4448 [DO-35]; Supplier: LCSC; JLCPCB Part Class: Extended Part; spicePre: V; spiceSymbolName: Диод импульсный 1N4448 [DO-35]; Add into BOM: yes; FootprintName: DO-35_BD2.0-L4.2-P8.20-D0.5-RD
VD114 = Диод импульсный 1N4448 [DO-35]: Manufacturer: onsemi; Manufacturer Part: 1N4448TR; Contributor: jordanjin; Convert to PCB: yes; UniqueId: ggec00ae156fd4c9668; Origin Footprint: DO-35_BD2.0-L4.2-P8.20-D0.5-RD; Device: Диод импульсный 1N4448 [DO-35]; Symbol: Диод импульсный 1N4448 [DO-35]; Supplier: LCSC; JLCPCB Part Class: Extended Part; spicePre: V; spiceSymbolName: Диод импульсный 1N4448 [DO-35]; Add into BOM: yes; FootprintName: DO-35_BD2.0-L4.2-P8.20-D0.5-RD
VD115 = Диод импульсный 1N4448 [DO-35]: Manufacturer: onsemi; Manufacturer Part: 1N4448TR; Contributor: jordanjin; Convert to PCB: yes; UniqueId: gged02e77e36bdff4e4; Origin Footprint: DO-35_BD2.0-L4.2-P8.20-D0.5-RD; Device: Диод импульсный 1N4448 [DO-35]; Symbol: Диод импульсный 1N4448 [DO-35]; Supplier: LCSC; JLCPCB Part Class: Extended Part; spicePre: V; spiceSymbolName: Диод импульсный 1N4448 [DO-35]; Add into BOM: yes; FootprintName: DO-35_BD2.0-L4.2-P8.20-D0.5-RD
VD116 = Диод импульсный 1N4448 [DO-35]: Manufacturer: onsemi; Manufacturer Part: 1N4448TR; Contributor: jordanjin; Convert to PCB: yes; UniqueId: gge7fab4cb7727db103; Origin Footprint: DO-35_BD2.0-L4.2-P8.20-D0.5-RD; Device: Диод импульсный 1N4448 [DO-35]; Symbol: Диод импульсный 1N4448 [DO-35]; Supplier: LCSC; JLCPCB Part Class: Extended Part; spicePre: V; spiceSymbolName: Диод импульсный 1N4448 [DO-35]; Add into BOM: yes; FootprintName: DO-35_BD2.0-L4.2-P8.20-D0.5-RD
VD117 = Диод импульсный 1N4448 [DO-35]: Manufacturer: onsemi; Manufacturer Part: 1N4448TR; Contributor: jordanjin; Convert to PCB: yes; UniqueId: gged1927a800476600c; Origin Footprint: DO-35_BD2.0-L4.2-P8.20-D0.5-RD; Device: Диод импульсный 1N4448 [DO-35]; Symbol: Диод импульсный 1N4448 [DO-35]; Supplier: LCSC; JLCPCB Part Class: Extended Part; spicePre: V; spiceSymbolName: Диод импульсный 1N4448 [DO-35]; Add into BOM: yes; FootprintName: DO-35_BD2.0-L4.2-P8.20-D0.5-RD
VD118 = Диод импульсный 1N4448 [DO-35]: Manufacturer: onsemi; Manufacturer Part: 1N4448TR; Contributor: jordanjin; Convert to PCB: yes; UniqueId: gge147911214a790f5a; Origin Footprint: DO-35_BD2.0-L4.2-P8.20-D0.5-RD; Device: Диод импульсный 1N4448 [DO-35]; Symbol: Диод импульсный 1N4448 [DO-35]; Supplier: LCSC; JLCPCB Part Class: Extended Part; spicePre: V; spiceSymbolName: Диод импульсный 1N4448 [DO-35]; Add into BOM: yes; FootprintName: DO-35_BD2.0-L4.2-P8.20-D0.5-RD
VD119 = Диод импульсный 1N4448 [DO-35]: Manufacturer: onsemi; Manufacturer Part: 1N4448TR; Contributor: jordanjin; Convert to PCB: yes; UniqueId: gge450b94f6d14b21bf; Origin Footprint: DO-35_BD2.0-L4.2-P8.20-D0.5-RD; Device: Диод импульсный 1N4448 [DO-35]; Symbol: Диод импульсный 1N4448 [DO-35]; Supplier: LCSC; JLCPCB Part Class: Extended Part; spicePre: V; spiceSymbolName: Диод импульсный 1N4448 [DO-35]; Add into BOM: yes; FootprintName: DO-35_BD2.0-L4.2-P8.20-D0.5-RD
VD120 = Диод импульсный 1N4448 [DO-35]: Manufacturer: onsemi; Manufacturer Part: 1N4448TR; Contributor: jordanjin; Convert to PCB: yes; UniqueId: gge3179cf16cbfb44c0; Origin Footprint: DO-35_BD2.0-L4.2-P8.20-D0.5-RD; Device: Диод импульсный 1N4448 [DO-35]; Symbol: Диод импульсный 1N4448 [DO-35]; Supplier: LCSC; JLCPCB Part Class: Extended Part; spicePre: V; spiceSymbolName: Диод импульсный 1N4448 [DO-35]; Add into BOM: yes; FootprintName: DO-35_BD2.0-L4.2-P8.20-D0.5-RD
VD121 = Диод импульсный 1N4448 [DO-35]: Manufacturer: onsemi; Manufacturer Part: 1N4448TR; Contributor: jordanjin; Convert to PCB: yes; UniqueId: gge16bafdcd8773b3af; Origin Footprint: DO-35_BD2.0-L4.2-P8.20-D0.5-RD; Device: Диод импульсный 1N4448 [DO-35]; Symbol: Диод импульсный 1N4448 [DO-35]; Supplier: LCSC; JLCPCB Part Class: Extended Part; spicePre: V; spiceSymbolName: Диод импульсный 1N4448 [DO-35]; Add into BOM: yes; FootprintName: DO-35_BD2.0-L4.2-P8.20-D0.5-RD
VD122 = Диод импульсный 1N4448 [DO-35]: Manufacturer: onsemi; Manufacturer Part: 1N4448TR; Contributor: jordanjin; Convert to PCB: yes; UniqueId: ggea08182b92e7ac852; Origin Footprint: DO-35_BD2.0-L4.2-P8.20-D0.5-RD; Device: Диод импульсный 1N4448 [DO-35]; Symbol: Диод импульсный 1N4448 [DO-35]; Supplier: LCSC; JLCPCB Part Class: Extended Part; spicePre: V; spiceSymbolName: Диод импульсный 1N4448 [DO-35]; Add into BOM: yes; FootprintName: DO-35_BD2.0-L4.2-P8.20-D0.5-RD
VD123 = Диод импульсный 1N4448 [DO-35]: Manufacturer: onsemi; Manufacturer Part: 1N4448TR; Contributor: jordanjin; Convert to PCB: yes; UniqueId: gge25a9f0d4d20149e0; Origin Footprint: DO-35_BD2.0-L4.2-P8.20-D0.5-RD; Device: Диод импульсный 1N4448 [DO-35]; Symbol: Диод импульсный 1N4448 [DO-35]; Supplier: LCSC; JLCPCB Part Class: Extended Part; spicePre: V; spiceSymbolName: Диод импульсный 1N4448 [DO-35]; Add into BOM: yes; FootprintName: DO-35_BD2.0-L4.2-P8.20-D0.5-RD
VD124 = Диод импульсный 1N4448 [DO-35]: Manufacturer: onsemi; Manufacturer Part: 1N4448TR; Contributor: jordanjin; Convert to PCB: yes; UniqueId: gge16fe8a640c6a618d; Origin Footprint: DO-35_BD2.0-L4.2-P8.20-D0.5-RD; Device: Диод импульсный 1N4448 [DO-35]; Symbol: Диод импульсный 1N4448 [DO-35]; Supplier: LCSC; JLCPCB Part Class: Extended Part; spicePre: V; spiceSymbolName: Диод импульсный 1N4448 [DO-35]; Add into BOM: yes; FootprintName: DO-35_BD2.0-L4.2-P8.20-D0.5-RD
VD125 = Диод импульсный 1N4448 [DO-35]: Manufacturer: onsemi; Manufacturer Part: 1N4448TR; Contributor: jordanjin; Convert to PCB: yes; UniqueId: gge541582f0119c4d36; Origin Footprint: DO-35_BD2.0-L4.2-P8.20-D0.5-RD; Device: Диод импульсный 1N4448 [DO-35]; Symbol: Диод импульсный 1N4448 [DO-35]; Supplier: LCSC; JLCPCB Part Class: Extended Part; spicePre: V; spiceSymbolName: Диод импульсный 1N4448 [DO-35]; Add into BOM: yes; FootprintName: DO-35_BD2.0-L4.2-P8.20-D0.5-RD
VD126 = Диод импульсный 1N4448 [DO-35]: Manufacturer: onsemi; Manufacturer Part: 1N4448TR; Contributor: jordanjin; Convert to PCB: yes; UniqueId: ggeee7252bc2dd23639; Origin Footprint: DO-35_BD2.0-L4.2-P8.20-D0.5-RD; Device: Диод импульсный 1N4448 [DO-35]; Symbol: Диод импульсный 1N4448 [DO-35]; Supplier: LCSC; JLCPCB Part Class: Extended Part; spicePre: V; spiceSymbolName: Диод импульсный 1N4448 [DO-35]; Add into BOM: yes; FootprintName: DO-35_BD2.0-L4.2-P8.20-D0.5-RD
VD127 VD128 = Диод импульсный 1N4448 [DO-35]: Manufacturer: onsemi; Manufacturer Part: 1N4448TR; Contributor: jordanjin; Convert to PCB: yes; UniqueId: gge246488279c87fbb7; Origin Footprint: DO-35_BD2.0-L4.2-P8.20-D0.5-RD; Device: Диод импульсный 1N4448 [DO-35]; Symbol: Диод импульсный 1N4448 [DO-35]; Supplier: LCSC; JLCPCB Part Class: Extended Part; spicePre: V; spiceSymbolName: Диод импульсный 1N4448 [DO-35]; Add into BOM: yes; FootprintName: DO-35_BD2.0-L4.2-P8.20-D0.5-RD
VT101 = Транзистор полевой MOSFET N-канальный BSS138BK [SOT-23-3]: Manufacturer: ElecSuper(静芯); Contributor: lcsc; Convert to PCB: yes; UniqueId: gge8792bcff5f0cbe56; Origin Footprint: SOT-23-3_L2.9-W1.3-P1.90-LS2.4-BR; Device: Транзистор полевой MOSFET N-канальный BSS138BK [SOT-23-3]; Symbol: Транзистор полевой MOSFET N-канальный BSS138BK [SOT-23-3]; Supplier: LCSC; Supplier Part: C5224267; Manufacturer Part: BSS138BK; JLCPCB Part Class: Extended Part; spicePre: Q; spiceSymbolName: BSS138BK; Add into BOM: yes; FootprintName: SOT-23-3_L2.9-W1.3-P1.90-LS2.4-BR
VT102 = Транзистор полевой MOSFET N-канальный BSS138BK [SOT-23-3]: Manufacturer: ElecSuper(静芯); Contributor: lcsc; Convert to PCB: yes; UniqueId: ggea0371602905d5c15; Origin Footprint: SOT-23-3_L2.9-W1.3-P1.90-LS2.4-BR; Device: Транзистор полевой MOSFET N-канальный BSS138BK [SOT-23-3]; Symbol: Транзистор полевой MOSFET N-канальный BSS138BK [SOT-23-3]; Supplier: LCSC; Supplier Part: C5224267; Manufacturer Part: BSS138BK; JLCPCB Part Class: Extended Part; spicePre: Q; spiceSymbolName: BSS138BK; Add into BOM: yes; FootprintName: SOT-23-3_L2.9-W1.3-P1.90-LS2.4-BR
VT103 = Транзистор полевой MOSFET N-канальный BSS138BK [SOT-23-3]: Manufacturer: ElecSuper(静芯); Contributor: lcsc; Convert to PCB: yes; UniqueId: gge1429afdf2c585460; Origin Footprint: SOT-23-3_L2.9-W1.3-P1.90-LS2.4-BR; Device: Транзистор полевой MOSFET N-канальный BSS138BK [SOT-23-3]; Symbol: Транзистор полевой MOSFET N-канальный BSS138BK [SOT-23-3]; Supplier: LCSC; Supplier Part: C5224267; Manufacturer Part: BSS138BK; JLCPCB Part Class: Extended Part; spicePre: Q; spiceSymbolName: BSS138BK; Add into BOM: yes; FootprintName: SOT-23-3_L2.9-W1.3-P1.90-LS2.4-BR
VT104 = Транзистор полевой MOSFET N-канальный BSS138BK [SOT-23-3]: Manufacturer: ElecSuper(静芯); Contributor: lcsc; Convert to PCB: yes; UniqueId: ggeb864250f3607abc7; Origin Footprint: SOT-23-3_L2.9-W1.3-P1.90-LS2.4-BR; Device: Транзистор полевой MOSFET N-канальный BSS138BK [SOT-23-3]; Symbol: Транзистор полевой MOSFET N-канальный BSS138BK [SOT-23-3]; Supplier: LCSC; Supplier Part: C5224267; Manufacturer Part: BSS138BK; JLCPCB Part Class: Extended Part; spicePre: Q; spiceSymbolName: BSS138BK; Add into BOM: yes; FootprintName: SOT-23-3_L2.9-W1.3-P1.90-LS2.4-BR
VT105 = Транзистор полевой MOSFET N-канальный BSS138BK [SOT-23-3]: Manufacturer: ElecSuper(静芯); Contributor: lcsc; Convert to PCB: yes; UniqueId: ggedee92230c75ee414; Origin Footprint: SOT-23-3_L2.9-W1.3-P1.90-LS2.4-BR; Device: Транзистор полевой MOSFET N-канальный BSS138BK [SOT-23-3]; Symbol: Транзистор полевой MOSFET N-канальный BSS138BK [SOT-23-3]; Supplier: LCSC; Supplier Part: C5224267; Manufacturer Part: BSS138BK; JLCPCB Part Class: Extended Part; spicePre: Q; spiceSymbolName: BSS138BK; Add into BOM: yes; FootprintName: SOT-23-3_L2.9-W1.3-P1.90-LS2.4-BR
VT106 = Транзистор полевой MOSFET N-канальный BSS138BK [SOT-23-3]: Manufacturer: ElecSuper(静芯); Contributor: lcsc; Convert to PCB: yes; UniqueId: gge8cb31266a5655e02; Origin Footprint: SOT-23-3_L2.9-W1.3-P1.90-LS2.4-BR; Device: Транзистор полевой MOSFET N-канальный BSS138BK [SOT-23-3]; Symbol: Транзистор полевой MOSFET N-канальный BSS138BK [SOT-23-3]; Supplier: LCSC; Supplier Part: C5224267; Manufacturer Part: BSS138BK; JLCPCB Part Class: Extended Part; spicePre: Q; spiceSymbolName: BSS138BK; Add into BOM: yes; FootprintName: SOT-23-3_L2.9-W1.3-P1.90-LS2.4-BR
VT107 = Транзистор полевой MOSFET N-канальный BSS138BK [SOT-23-3]: Manufacturer: ElecSuper(静芯); Contributor: lcsc; Convert to PCB: yes; UniqueId: ggeb5b1c9e11f94c9a1; Origin Footprint: SOT-23-3_L2.9-W1.3-P1.90-LS2.4-BR; Device: Транзистор полевой MOSFET N-канальный BSS138BK [SOT-23-3]; Symbol: Транзистор полевой MOSFET N-канальный BSS138BK [SOT-23-3]; Supplier: LCSC; Supplier Part: C5224267; Manufacturer Part: BSS138BK; JLCPCB Part Class: Extended Part; spicePre: Q; spiceSymbolName: BSS138BK; Add into BOM: yes; FootprintName: SOT-23-3_L2.9-W1.3-P1.90-LS2.4-BR
VT108 = Транзистор полевой MOSFET N-канальный BSS138BK [SOT-23-3]: Manufacturer: ElecSuper(静芯); Contributor: lcsc; Convert to PCB: yes; UniqueId: gge236253568f683054; Origin Footprint: SOT-23-3_L2.9-W1.3-P1.90-LS2.4-BR; Device: Транзистор полевой MOSFET N-канальный BSS138BK [SOT-23-3]; Symbol: Транзистор полевой MOSFET N-канальный BSS138BK [SOT-23-3]; Supplier: LCSC; Supplier Part: C5224267; Manufacturer Part: BSS138BK; JLCPCB Part Class: Extended Part; spicePre: Q; spiceSymbolName: BSS138BK; Add into BOM: yes; FootprintName: SOT-23-3_L2.9-W1.3-P1.90-LS2.4-BR
VT109 = Транзистор полевой MOSFET N-канальный BSS138BK [SOT-23-3]: Manufacturer: ElecSuper(静芯); Contributor: lcsc; Convert to PCB: yes; UniqueId: ggeea7b5d05107eec70; Origin Footprint: SOT-23-3_L2.9-W1.3-P1.90-LS2.4-BR; Device: Транзистор полевой MOSFET N-канальный BSS138BK [SOT-23-3]; Symbol: Транзистор полевой MOSFET N-канальный BSS138BK [SOT-23-3]; Supplier: LCSC; Supplier Part: C5224267; Manufacturer Part: BSS138BK; JLCPCB Part Class: Extended Part; spicePre: Q; spiceSymbolName: BSS138BK; Add into BOM: yes; FootprintName: SOT-23-3_L2.9-W1.3-P1.90-LS2.4-BR
VT110 = Транзистор полевой MOSFET N-канальный BSS138BK [SOT-23-3]: Manufacturer: ElecSuper(静芯); Contributor: lcsc; Convert to PCB: yes; UniqueId: gge60e6376a72c64a45; Origin Footprint: SOT-23-3_L2.9-W1.3-P1.90-LS2.4-BR; Device: Транзистор полевой MOSFET N-канальный BSS138BK [SOT-23-3]; Symbol: Транзистор полевой MOSFET N-канальный BSS138BK [SOT-23-3]; Supplier: LCSC; Supplier Part: C5224267; Manufacturer Part: BSS138BK; JLCPCB Part Class: Extended Part; spicePre: Q; spiceSymbolName: BSS138BK; Add into BOM: yes; FootprintName: SOT-23-3_L2.9-W1.3-P1.90-LS2.4-BR
VT111 = Транзистор полевой MOSFET N-канальный BSS138BK [SOT-23-3]: Manufacturer: ElecSuper(静芯); Contributor: lcsc; Convert to PCB: yes; UniqueId: ggea5da7f6312e7299f; Origin Footprint: SOT-23-3_L2.9-W1.3-P1.90-LS2.4-BR; Device: Транзистор полевой MOSFET N-канальный BSS138BK [SOT-23-3]; Symbol: Транзистор полевой MOSFET N-канальный BSS138BK [SOT-23-3]; Supplier: LCSC; Supplier Part: C5224267; Manufacturer Part: BSS138BK; JLCPCB Part Class: Extended Part; spicePre: Q; spiceSymbolName: BSS138BK; Add into BOM: yes; FootprintName: SOT-23-3_L2.9-W1.3-P1.90-LS2.4-BR
VT112 = Транзистор полевой MOSFET N-канальный BSS138BK [SOT-23-3]: Manufacturer: ElecSuper(静芯); Contributor: lcsc; Convert to PCB: yes; UniqueId: gge1dc89095c85386c3; Origin Footprint: SOT-23-3_L2.9-W1.3-P1.90-LS2.4-BR; Device: Транзистор полевой MOSFET N-канальный BSS138BK [SOT-23-3]; Symbol: Транзистор полевой MOSFET N-канальный BSS138BK [SOT-23-3]; Supplier: LCSC; Supplier Part: C5224267; Manufacturer Part: BSS138BK; JLCPCB Part Class: Extended Part; spicePre: Q; spiceSymbolName: BSS138BK; Add into BOM: yes; FootprintName: SOT-23-3_L2.9-W1.3-P1.90-LS2.4-BR
VT113 = Транзистор полевой MOSFET N-канальный BSS138BK [SOT-23-3]: Manufacturer: ElecSuper(静芯); Contributor: lcsc; Convert to PCB: yes; UniqueId: gge030e1253f0ceda81; Origin Footprint: SOT-23-3_L2.9-W1.3-P1.90-LS2.4-BR; Device: Транзистор полевой MOSFET N-канальный BSS138BK [SOT-23-3]; Symbol: Транзистор полевой MOSFET N-канальный BSS138BK [SOT-23-3]; Supplier: LCSC; Supplier Part: C5224267; Manufacturer Part: BSS138BK; JLCPCB Part Class: Extended Part; spicePre: Q; spiceSymbolName: BSS138BK; Add into BOM: yes; FootprintName: SOT-23-3_L2.9-W1.3-P1.90-LS2.4-BR
VT114 = Транзистор полевой MOSFET N-канальный BSS138BK [SOT-23-3]: Manufacturer: ElecSuper(静芯); Contributor: lcsc; Convert to PCB: yes; UniqueId: gge129fd8e6a3a1c7e7; Origin Footprint: SOT-23-3_L2.9-W1.3-P1.90-LS2.4-BR; Device: Транзистор полевой MOSFET N-канальный BSS138BK [SOT-23-3]; Symbol: Транзистор полевой MOSFET N-канальный BSS138BK [SOT-23-3]; Supplier: LCSC; Supplier Part: C5224267; Manufacturer Part: BSS138BK; JLCPCB Part Class: Extended Part; spicePre: Q; spiceSymbolName: BSS138BK; Add into BOM: yes; FootprintName: SOT-23-3_L2.9-W1.3-P1.90-LS2.4-BR
VT115 = Транзистор полевой MOSFET N-канальный BSS138BK [SOT-23-3]: Manufacturer: ElecSuper(静芯); Contributor: lcsc; Convert to PCB: yes; UniqueId: ggef40e84c15a2b61ae; Origin Footprint: SOT-23-3_L2.9-W1.3-P1.90-LS2.4-BR; Device: Транзистор полевой MOSFET N-канальный BSS138BK [SOT-23-3]; Symbol: Транзистор полевой MOSFET N-канальный BSS138BK [SOT-23-3]; Supplier: LCSC; Supplier Part: C5224267; Manufacturer Part: BSS138BK; JLCPCB Part Class: Extended Part; spicePre: Q; spiceSymbolName: BSS138BK; Add into BOM: yes; FootprintName: SOT-23-3_L2.9-W1.3-P1.90-LS2.4-BR
VT116 = Транзистор полевой MOSFET N-канальный BSS138BK [SOT-23-3]: Manufacturer: ElecSuper(静芯); Contributor: lcsc; Convert to PCB: yes; UniqueId: gge96b2b732c9f4f151; Origin Footprint: SOT-23-3_L2.9-W1.3-P1.90-LS2.4-BR; Device: Транзистор полевой MOSFET N-канальный BSS138BK [SOT-23-3]; Symbol: Транзистор полевой MOSFET N-канальный BSS138BK [SOT-23-3]; Supplier: LCSC; Supplier Part: C5224267; Manufacturer Part: BSS138BK; JLCPCB Part Class: Extended Part; spicePre: Q; spiceSymbolName: BSS138BK; Add into BOM: yes; FootprintName: SOT-23-3_L2.9-W1.3-P1.90-LS2.4-BR
VT117 = Транзистор полевой MOSFET N-канальный BSS138BK [SOT-23-3]: Manufacturer: ElecSuper(静芯); Contributor: lcsc; Convert to PCB: yes; UniqueId: gge4df12748e8334087; Origin Footprint: SOT-23-3_L2.9-W1.3-P1.90-LS2.4-BR; Device: Транзистор полевой MOSFET N-канальный BSS138BK [SOT-23-3]; Symbol: Транзистор полевой MOSFET N-канальный BSS138BK [SOT-23-3]; Supplier: LCSC; Supplier Part: C5224267; Manufacturer Part: BSS138BK; JLCPCB Part Class: Extended Part; spicePre: Q; spiceSymbolName: BSS138BK; Add into BOM: yes; FootprintName: SOT-23-3_L2.9-W1.3-P1.90-LS2.4-BR
VT118 VT119 = Транзистор полевой MOSFET N-канальный BSS138BK [SOT-23-3]: Manufacturer: ElecSuper(静芯); Contributor: lcsc; Convert to PCB: yes; UniqueId: ggee4b5e09a670cbf37; Origin Footprint: SOT-23-3_L2.9-W1.3-P1.90-LS2.4-BR; Device: Транзистор полевой MOSFET N-канальный BSS138BK [SOT-23-3]; Symbol: Транзистор полевой MOSFET N-канальный BSS138BK [SOT-23-3]; Supplier: LCSC; Supplier Part: C5224267; Manufacturer Part: BSS138BK; JLCPCB Part Class: Extended Part; spicePre: Q; spiceSymbolName: BSS138BK; Add into BOM: yes; FootprintName: SOT-23-3_L2.9-W1.3-P1.90-LS2.4-BR
XP103 = Вилка на плату прямая BH-10 (DS1013-10S) 10pin шаг 2.54мм: Manufacturer: CONNFLY; Manufacturer Part: DS1013-10SSiB1-B-0; Contributor: jordanjin; Convert to PCB: yes; UniqueId: gge076e298fc8fb1dc6; ModelId: 803ffb6ab3ed4cb6af6e6de489a37367; Origin Footprint: IDC-TH_10P-P2.54-V-R2-C5-S2.54; Device: Вилка на плату прямая BH-10 (DS1013-10S) 10pin шаг 2.54мм; Symbol: Вилка на плату прямая BH-10 (DS1013-10S) 10pin шаг 2.54мм; Supplier: LCSC; JLCPCB Part Class: Extended Part; spicePre: X; spiceSymbolName: Вилка на плату прямая BH-10 (DS1013-10S) 10pin шаг 2.54мм; Add into BOM: yes; FootprintName: IDC-TH_10P-P2.54-V-R2-C5-S2.54; ModelName: IDC-TH_10P-P2.54-V-R2-C5-S2.54